# Altium schematic sheet WQLT.SchDoc
size A4
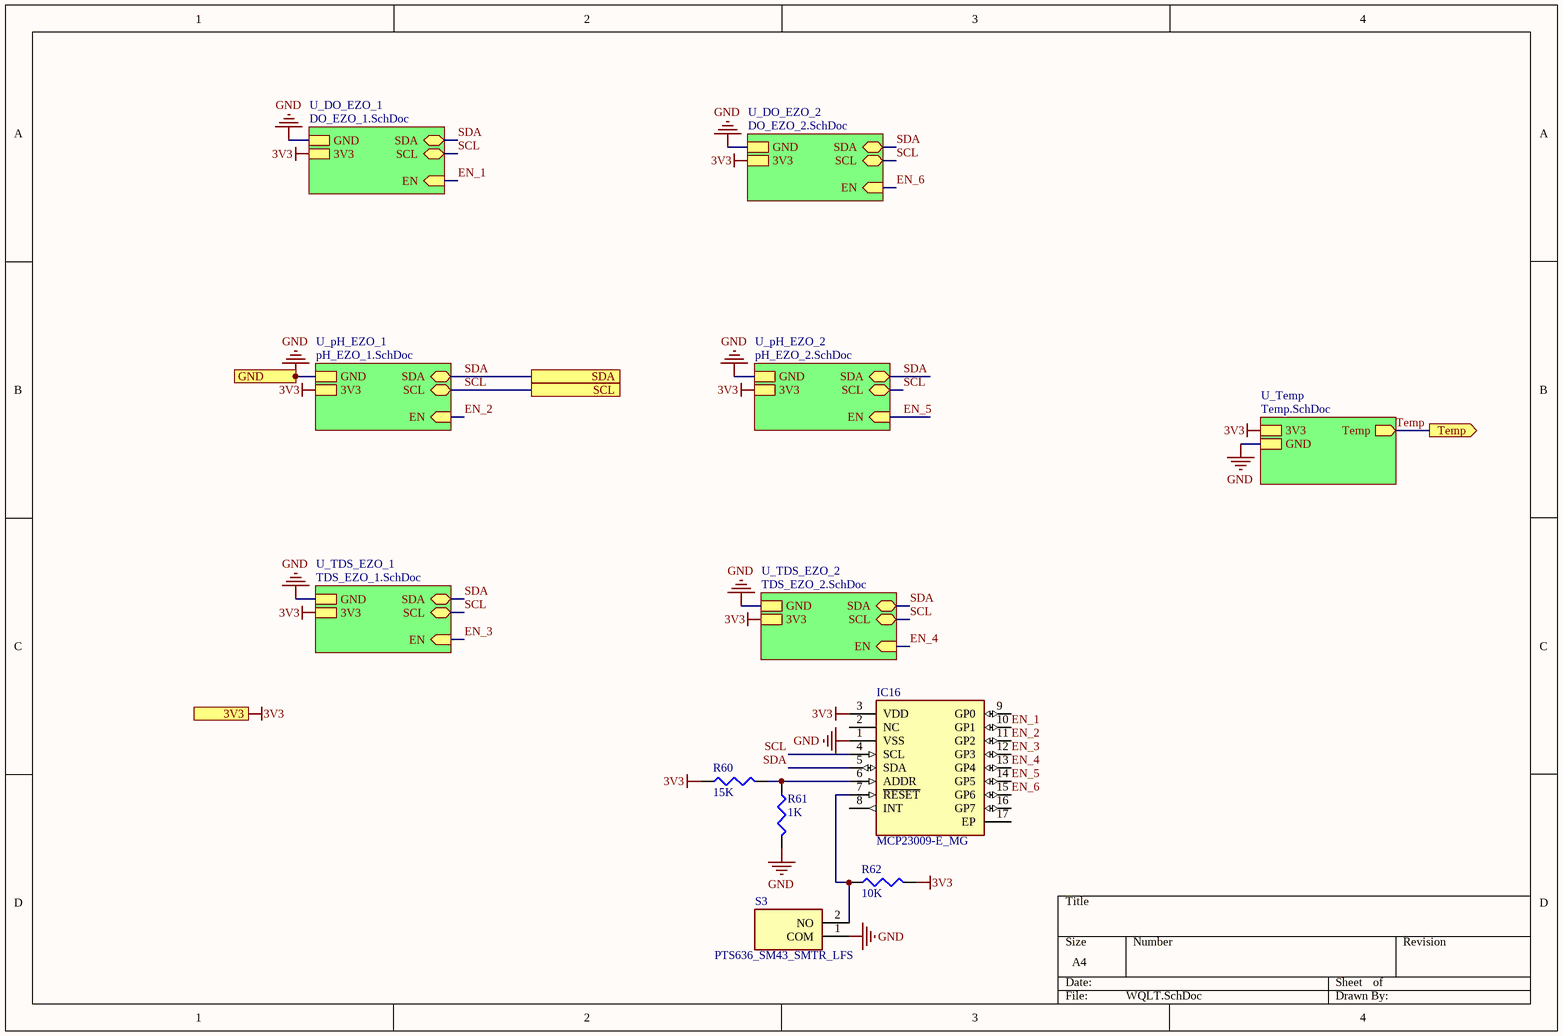
[diagram p0: WQLT.SchDoc]

## Parts
IC16  MCP23009-E_MG  [QFN50P300X300X90-17N-D]
R60  15K  [J1-0603]
R61  1K  [J1-0603]
R62  10K  [J1-0603]
S3  PTS636_SM43_SMTR_LFS  [PTS636SM43SMTRLFS]

## Sub-sheets
U_DO_EZO_1 = DO_EZO_1.SchDoc: SCL (bidir), GND, EN (in), SDA (bidir), 3V3
U_DO_EZO_2 = DO_EZO_2.SchDoc: SCL (bidir), GND, EN (in), SDA (bidir), 3V3
U_pH_EZO_1 = pH_EZO_1.SchDoc: SDA (bidir), EN (in), SCL (bidir), GND, 3V3
U_pH_EZO_2 = pH_EZO_2.SchDoc: SDA (bidir), EN (in), 3V3, SCL (bidir), GND
U_TDS_EZO_1 = TDS_EZO_1.SchDoc: SDA (bidir), EN (in), SCL (bidir), 3V3, GND
U_TDS_EZO_2 = TDS_EZO_2.SchDoc: SDA (bidir), EN (in), SCL (bidir), 3V3, GND
U_Temp = Temp.SchDoc: 3V3, Temp (out), GND

## Ports
3V3, GND, SCL, SDA, Temp (out)

## Nets
3V3: IC16.3(VDD) R60.1 R62.2 ; port 3V3, sheet U_TDS_EZO_2/3V3, sheet U_Temp/3V3, sheet U_DO_EZO_1/3V3, sheet U_TDS_EZO_1/3V3, sheet U_DO_EZO_2/3V3, sheet U_pH_EZO_1/3V3, sheet U_pH_EZO_2/3V3
GND: IC16.1(VSS) R61.2 S3.1(COM) ; port GND, sheet U_TDS_EZO_2/GND, sheet U_Temp/GND, sheet U_DO_EZO_1/GND, sheet U_TDS_EZO_1/GND, sheet U_DO_EZO_2/GND, sheet U_pH_EZO_1/GND, sheet U_pH_EZO_2/GND
EN_1: IC16.10(GP1) ; sheet U_DO_EZO_1/EN
EN_2: IC16.11(GP2) ; sheet U_pH_EZO_1/EN
EN_3: IC16.12(GP3) ; sheet U_TDS_EZO_1/EN
EN_4: IC16.13(GP4) ; sheet U_TDS_EZO_2/EN
EN_5: IC16.14(GP5) ; sheet U_pH_EZO_2/EN
EN_6: IC16.15(GP6) ; sheet U_DO_EZO_2/EN
SCL: IC16.4(SCL) ; port SCL, sheet U_TDS_EZO_2/SCL, sheet U_DO_EZO_1/SCL, sheet U_TDS_EZO_1/SCL, sheet U_DO_EZO_2/SCL, sheet U_pH_EZO_1/SCL, sheet U_pH_EZO_2/SCL
SDA: IC16.5(SDA) ; port SDA, sheet U_TDS_EZO_2/SDA, sheet U_DO_EZO_1/SDA, sheet U_TDS_EZO_1/SDA, sheet U_DO_EZO_2/SDA, sheet U_pH_EZO_1/SDA, sheet U_pH_EZO_2/SDA
Temp: port Temp, sheet U_Temp/Temp
NetIC16_6: IC16.6(ADDR) R60.2 R61.1
NetIC16_7: IC16.7(~{RESET}) R62.1 S3.2(NO)

Not connected (* = marked no-connect by the designer): IC16 2(NC) 8(INT) 9(GP0) 16(GP7) 17(EP)

## Library data of the parts
IC16 = MCP23009-E_MG: Integrated Circuit; Manufacturer_Name: Microchip; Manufacturer_Part_Number: MCP23009-E/MG; Datasheet Link: http://ww1.microchip.com/downloads/en/DeviceDoc/20002121C.pdf; Height: 0.9mm; Mouser Part Number: 579-MCP23009-E/MG; Mouser Price/Stock: https://www.mouser.co.uk/ProductDetail/Microchip-Technology/MCP23009-E-MG?qs=Xb8IjHhkxj5%2FhepKZpS8CQ%3D%3D; Arrow Part Number: MCP23009-E/MG; Arrow Price/Stock: https://www.arrow.com/en/products/mcp23009-emg/microchip-technology
R60-R62 = Res3: Resistor; Published: 8-Jun-2000; LatestRevisionDate: 29-May-2009; LatestRevisionNote: IPC-7351 Footprint Added.; PackageReference: J1-0603; Publisher: Altium Limited; PackageDescription: Chip Resistor
  R60: Value: 15K
  R61: Value: 1K
  R62: Value: 10K
S3 = PTS636_SM43_SMTR_LFS: Switch; Manufacturer_Name: C & K COMPONENTS; Manufacturer_Part_Number: PTS636 SM43 SMTR LFS; Datasheet Link: https://componentsearchengine.com/Datasheets/1/PTS636 SM43 SMTR LFS.pdf; Height: 4.5mm; Mouser Part Number: 611-PTS636SM43SMTRLF; Mouser Price/Stock: https://www.mouser.co.uk/ProductDetail/CK/PTS636-SM43-SMTR-LFS?qs=vLWxofP3U2xu5raMGkTmHg%3D%3D; Arrow Part Number: PTS636 SM43 SMTR LFS; Arrow Price/Stock: https://www.arrow.com/en/products/pts636-sm43-smtr-lfs/ck